# EasyEDA schematic SCH_esig_2025-06-15.json
TITLE: Arduino_based_electronic_cigar; REV: 1.1; Date: 2025-05-27; Sheet: 1/1; Company: https://github.com/Kaan1656
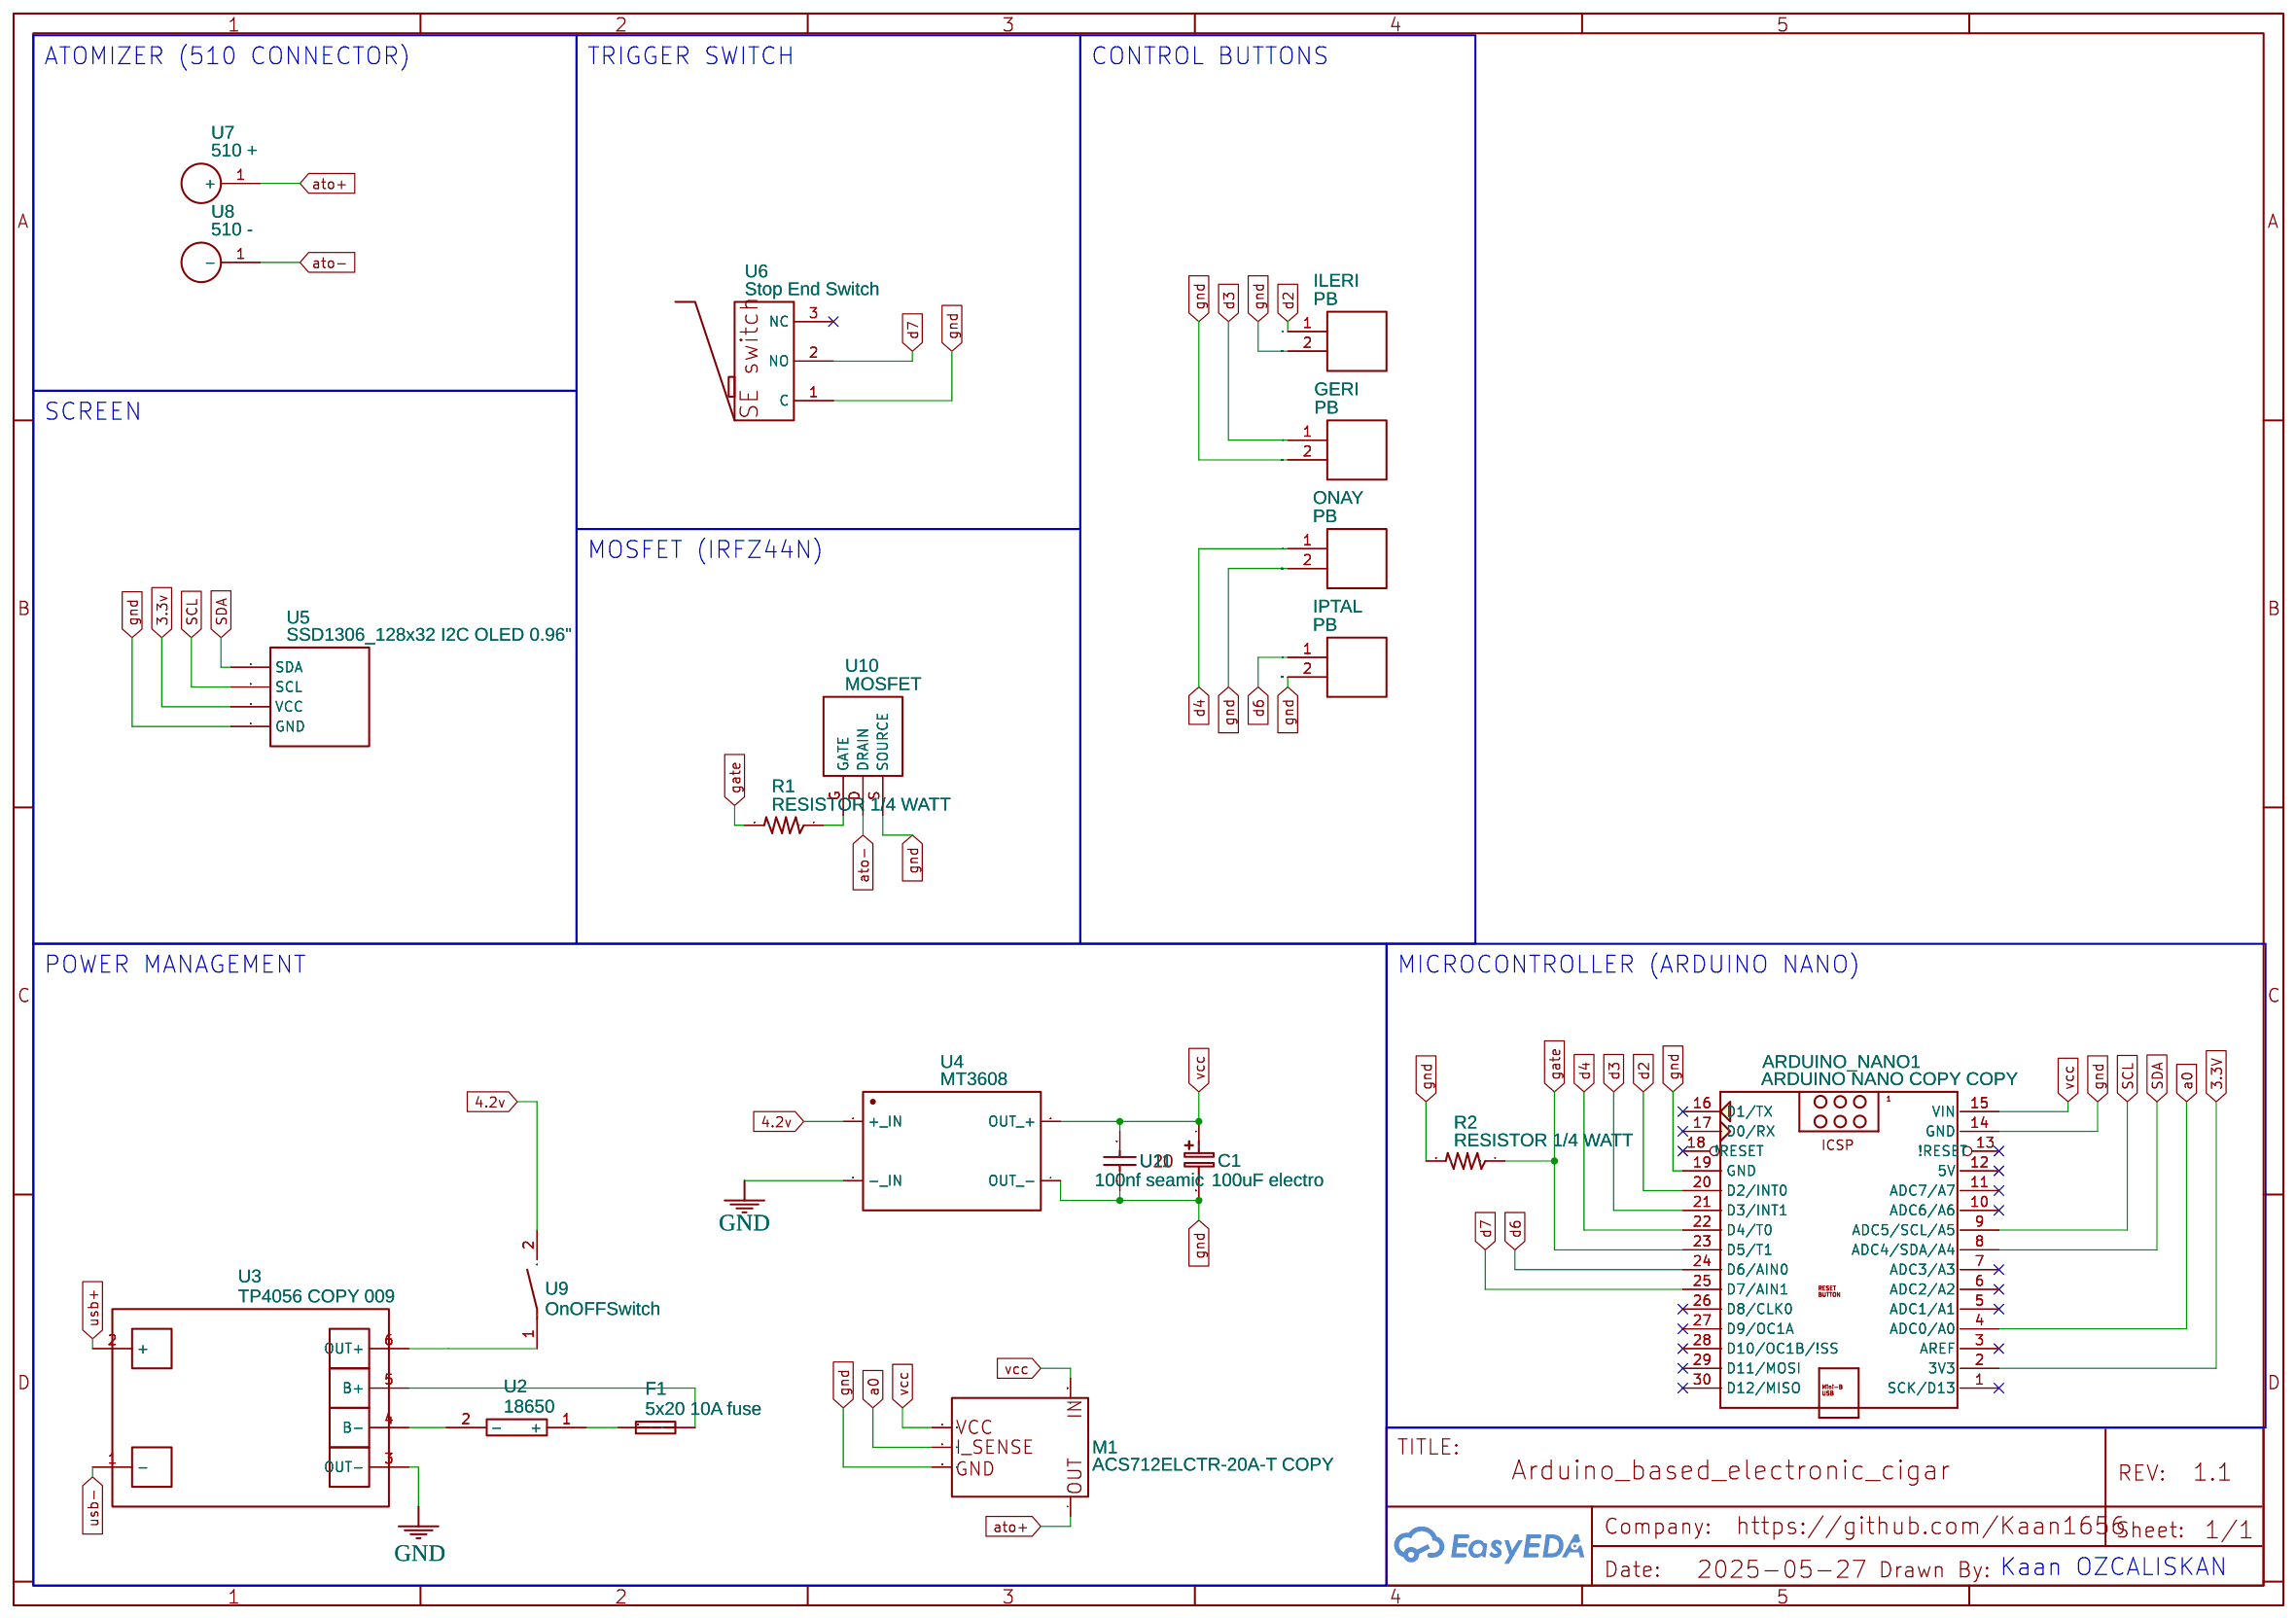
[diagram p0: schematic sheet]

## Parts
ARDUINO_NANO1  ARDUINO NANO COPY COPY  [ARDUINONANOV30_ARDUINO_NANO]
C1  100uF electro  [ELECTROLITIC_10_20.5]
F1  5x20 10A fuse  [GLASS FUSER HOLDER 5X20]
GERI  PB  [MY PUSHBUTTON]
ILERI  PB  [MY PUSHBUTTON]
IPTAL  PB  [MY PUSHBUTTON]
M1  ACS712ELCTR-20A-T COPY  [ACS712]
ONAY  PB  [MY PUSHBUTTON]
R1  RESISTOR 1/4 WATT  [1/4 WATT RESISTOR 1/4]
R2  RESISTOR 1/4 WATT  [1/4 WATT RESISTOR 1/4]
U2  18650  [18650_MOUNT_FP]
U3  TP4056 COPY 009  [TP4056]
U4  MT3608  [DC-DC UP MT3608]
U5  SSD1306_128x32 I2C OLED 0.96"  [SSD1306_128X32]
U6  Stop End Switch  [STOP END SWITCH]
U7  510 +  [WIRE HOLE 20AWG]
U8  510 -  [WIRE HOLE 20AWG]
U9  OnOFFSwitch  [ONOFFSWITCH]
U10  MOSFET  [IRLZ44N]
U11  100nf seamic  [LARGE SERAMIC CAPACITOR]

## Library data of the parts
ARDUINO_NANO1 = ARDUINO NANO COPY COPY: Contributor: hrodriguez22
C1 = ELECTROLITIC_10MM_20.5MM: Contributor: milleski
F1 = GLASS_FUSE_5X20: Contributor: colibrilab
GERI ILERI IPTAL ONAY = MY pushbutton: Contributor: aldomezadev
M1 = ACS712ELCTR-20A-T COPY: Contributor: banjerdmaising3
R1 R2 = RESISTOR 1/4 WATT TH Ω: Mounted: Yes; Contributor: akhilesh.das07
U2 = 18650_Mount: Contributor: Lukas Krämer
U3 = TP4056 COPY 009: Contributor: randy.kamarga
U4 = MT3806: Manufacturer: NoName; Manufacturer Part: MT3806 DC-DC Step Up; Supplier: Aliexpress; Contributor: daversky
U5 = SSD1306_128x32 I2C OLED 0.96": Contributor: Scikraft
U6 = Stop End Switch: Contributor: 1364806
U7 U8 = wire hole 20AWG: Contributor: mohammad haidzir
U9 = OnOFFSwitch: Contributor: andrewivkh
U10 = MOSFET: Contributor: sergei_anaaanyev
U11 = Large seramic capacitor: Contributor: Sharifcon

## Nets
3.3V: ARDUINO_NANO1.2(3V3)
3.3v: U5.3(VCC)
4.2v: U4.1(+ IN) U9.2
GND: U3.3(OUT-) U4.2(- IN)
gnd: ARDUINO_NANO1.14(GND) ARDUINO_NANO1.19(GND) C1.2 GERI.2(Pushbutton) ILERI.2(Pushbutton) IPTAL.2(Pushbutton) M1.3(5) ONAY.2(Pushbutton) R2.2 U4.4(OUT -) U5.4(GND) U6.1(C) U10.S(SOURCE) U11.1
vcc: ARDUINO_NANO1.15(VIN) C1.1 M1.1(3) M1.5(1) U4.3(OUT +) U11.2
a0: ARDUINO_NANO1.4(ADC0/A0) M1.2(4)
ato+: M1.4(2) U7.1(+)
ato-: U8.1(-) U10.D(DRAIN)
d2: ARDUINO_NANO1.20(D2/INT0) ILERI.1
d3: ARDUINO_NANO1.21(D3/INT1) GERI.1
d4: ARDUINO_NANO1.22(D4/T0) ONAY.1
d6: ARDUINO_NANO1.24(D6/AIN0) IPTAL.1
d7: ARDUINO_NANO1.25(D7/AIN1) U6.2(NO)
gate: ARDUINO_NANO1.23(D5/T1) R1.2 R2.1
SCL: ARDUINO_NANO1.9(ADC5/SCL/A5) U5.2(SCL)
SDA: ARDUINO_NANO1.8(ADC4/SDA/A4) U5.1(SDA)
usb+: U3.2(+)
usb-: U3.1(-)
Net-(F1-1): F1.1 U3.5(B+)
Net-(F1-2): F1.2 U2.1(+)
Net-(R1-1): R1.1 U10.G(GATE)
Net-(U2-2): U2.2(-) U3.4(B-)
Net-(U3-6): U3.6(OUT+) U9.1

Not connected (* = marked no-connect by the designer): ARDUINO_NANO1 1(SCK/D13)* 3(AREF)* 5(ADC1/A1)* 6(ADC2/A2)* 7(ADC3/A3)* 10(ADC6/A6)* 11(ADC7/A7)* 12(5V)* 13(!RESET)* 16(D1/TX)* 17(D0/RX)* 18(!RESET)* 26(D8/CLK0)* 27(D9/OC1A)* 28(D10/OC1B/!SS)* 29(D11/MOSI)* 30(D12/MISO)*; U6 3(NC)*

## Notes on the sheet
- ATOMIZER (510 CONNECTOR)
- TRIGGER SWITCH
- CONTROL BUTTONS
- SCREEN
- MOSFET (IRFZ44N)
- POWER MANAGEMENT
- MICROCONTROLLER (ARDUINO NANO)
- Kaan OZCALISKAN
